# EAGLE design Me-Infrared Reciver Decode v2.0 (EAGLE 6.2)
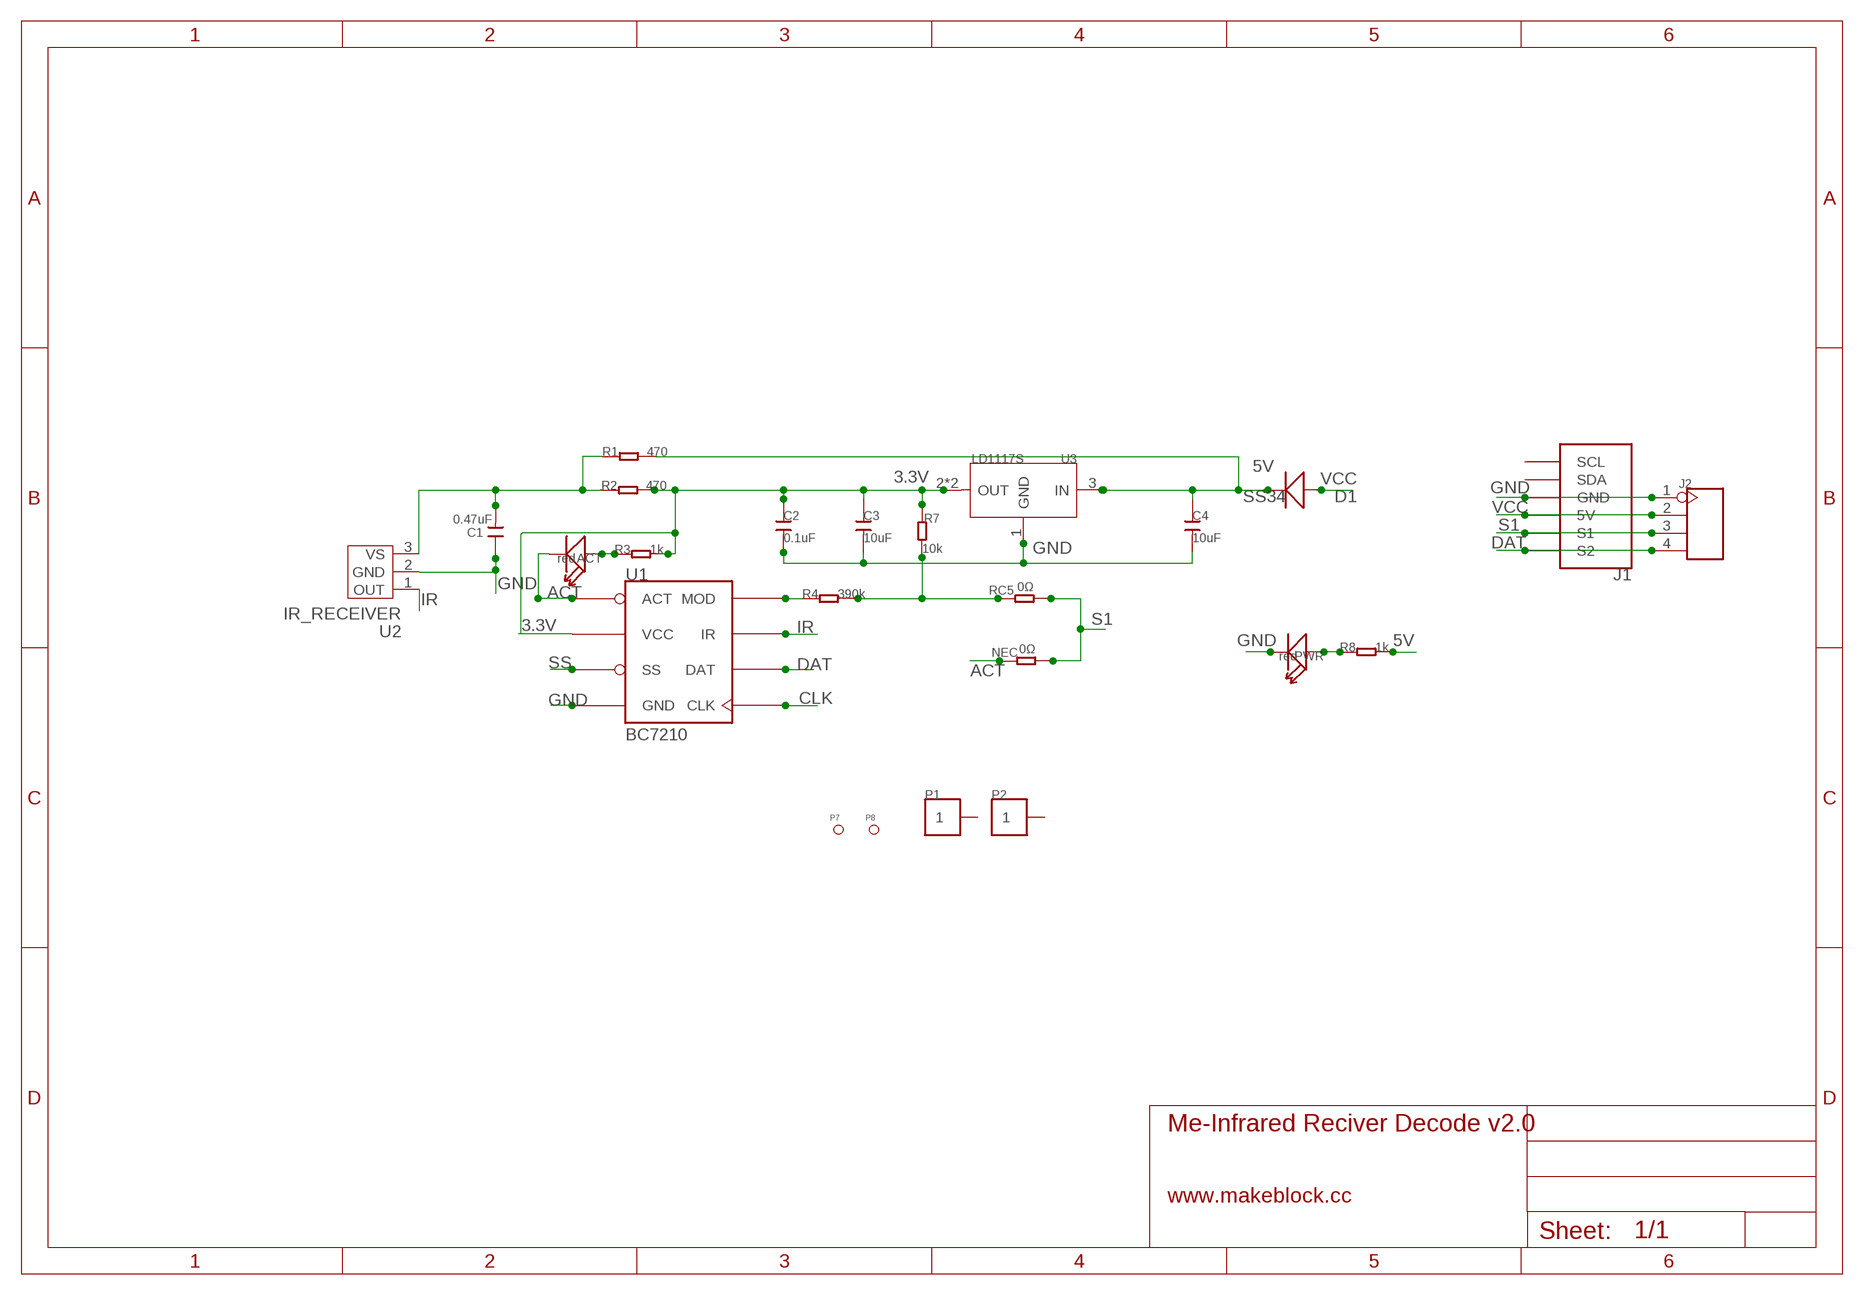
[diagram p0: schematic, sheet 1]

## Parts
ACT  red  LED'0603'  [LED-0603]
C1  0.47uF  C-0603  [0603]
C2  0.1uF  C-0603  [0603]
C3  10uF  C-0603  [0603]
C4  10uF  C-0603  [0603]
D1  SS34  D'SMA'  [D2010]
J1  RJ11-6P6C-DIGI  [RJ11-6P6C]
J2  HEADER-4P-60/35MIL  [4P-65/35MIL]
NEC  0Ω  R-0603  [0603]
P1  PAD-1P-4MM  [HOLE-01]
P2  PAD-1P-4MM  [HOLE-01]
P7  PAD-MARK  [ROUND-MARK-1.0]
P8  PAD-MARK  [ROUND-MARK-1.0]
PWR  red  LED'0603'  [LED-0603]
R1  470  R-0603  [0603]
R2  470  R-0603  [0603]
R3  1k  R-0603  [0603]
R4  390k  R-0603  [0603]
R7  10k  R-0603  [0603]
R8  1k  R-0603  [0603]
RC5  0Ω  R-0603  [0603]
U1  BC7210  [BC7210]
U2  IR_RECEIVER  [IR_RECEIVER]
U3  LD1117S  [SOT-223]

## Nets
3.3V: C2.1 C3.1 R2.2 R3.2 R7.2 U1.P$2(VCC) U3.2(OUT) U3.TER(OUT)
5V: C4.1 D1.- R1.2 R8.2 U3.3(IN)
ACT: ACT.- NEC.1 U1.P$1(ACT)
CLK: U1.P$5(CLK)
DAT: J1.6(S2) J2.4 U1.P$6(DAT)
GND: C1.1 C2.2 C3.2 C4.2 J1.3(GND) J2.1 PWR.- U1.P$4(GND) U2.2(GND) U3.1(GND)
IR: U1.P$7(IR) U2.1(OUT)
N$1: R4.1 U1.P$8(MOD)
N$2: PWR.+ R8.1
N$3: C1.2 R1.1 R2.1 U2.3(VS)
N$4: R4.2 R7.1 RC5.1
N$6: ACT.+ R3.1
S1: J1.5(S1) J2.3 NEC.2 RC5.2
SS: U1.P$3(SS)
VCC: D1.+ J1.4(5V) J2.2
Unconnected: J1.1(SCL) J1.2(SDA) P1.1 P2.1

## Notes on the sheet
- www.makeblock.cc

## Library data of the parts
ACT PWR = Discrete:LED*
C1-C4 = Discrete:C*: Ceramic Capacitors
D1 = Discrete:D*
J1 = Makeblock:RJ11-6P6C-DIGI
J2 = Connector:HEADER-4P
NEC R1-R4 R7 R8 RC5 = Discrete:R*
P1 P2 = Makeblock:PAD-1P*
P7 P8 = Discrete:PAD-MARK; PARTNO: DNP
U1 = Makeblock:BC7210
U2 = Makeblock:IR_RECEIVER
U3 = IC:LD1117: Low Drop Fixed And Adjustable Positive Voltage Regulators http://www.datasheetcatalog.org/datasheet/SGSThomsonMicroelectronics/mXuqtqv.pdf

## Board
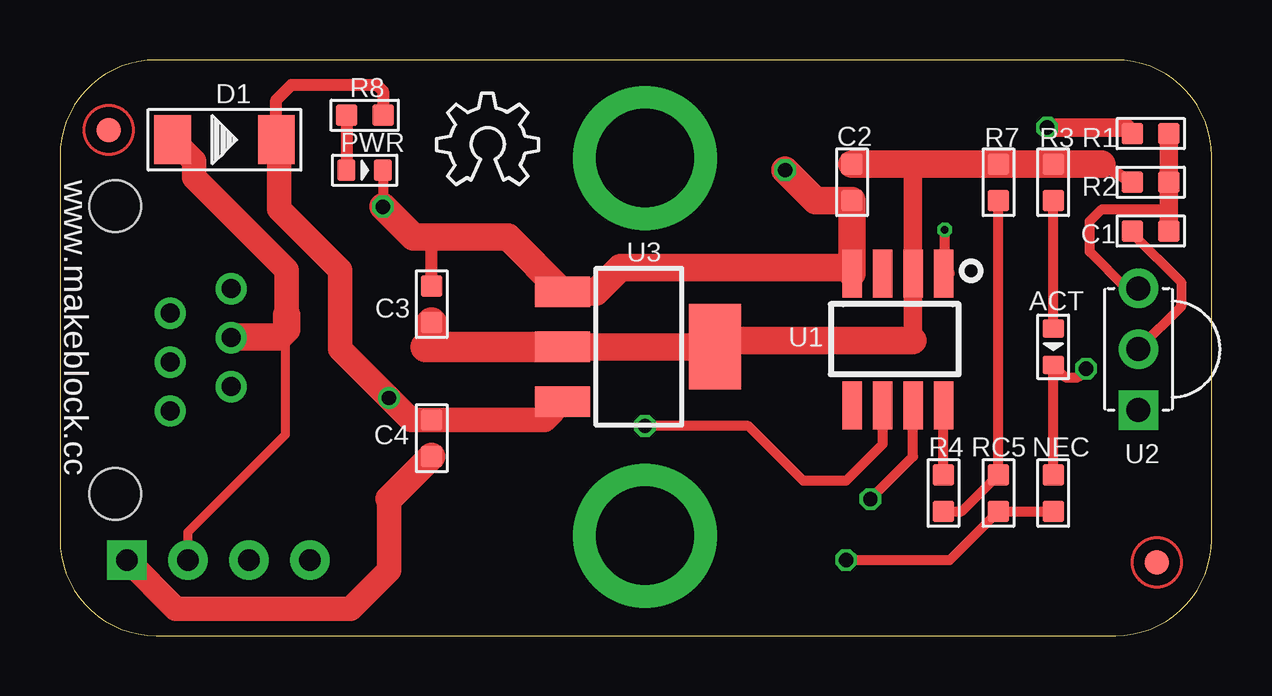
[diagram p1: board, top side]
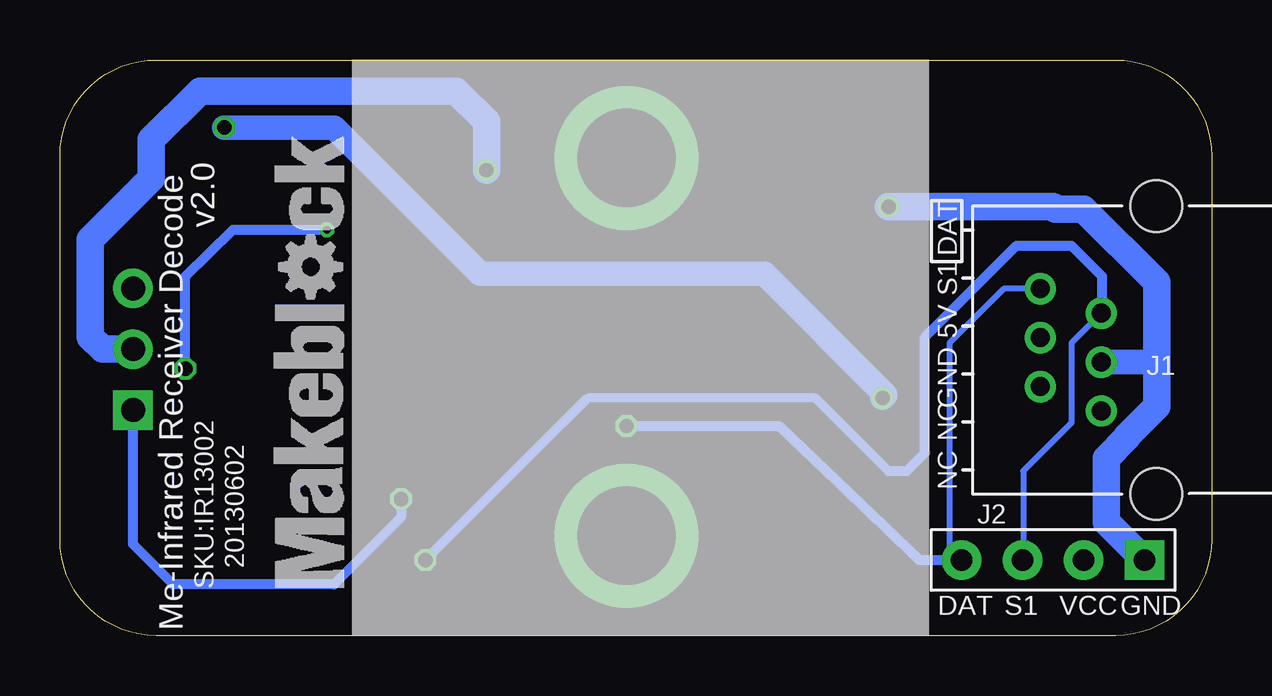
[diagram p2: board, bottom side, seen from below]

Size 48 x 24 mm. Coordinates in mm from the lower left corner, seen from the top.
Outline: 0,20 0,4 arc90 4,0 44,0 arc90 48,4 48,20 arc90 44,24 4,24 arc90 0,20
Copper layers (1*16): Top 0.035mm / dielectric 1.5mm / Bottom 0.035mm
Design rules: minimum track width 6mil, minimum drill 12mil, track to track 8mil, track to pad 8mil, pad to pad 8mil, via to via 8mil, smd to smd 0mil, copper to edge 10mil, drill to drill 10mil, minimum pad ring 10mil, minimum via ring 6mil, stop-mask expansion 2mil, vias tented up to drill 100mil, thermal gap 10mil

### Footprints (pad centres in the part's own frame; a part is rotated, then mirrored left to right if it is on the bottom)
LED-0603 = smd 0.762 x 0.889: + -0.762,0; - 0.762,0
0603 = smd 0.889 x 0.889: 1 -0.762,0; 2 0.762,0
D2010 = smd 1.524 x 2.032: + -2.159,0; - 2.159,0
RJ11-6P6C = drill 0.8: 1 -2.55,1.8; 2 -1.53,4.34; 3 -0.51,1.8; 4 0.51,4.34; 5 1.53,1.8; 6 2.55,4.34 | hole 2.15: -6,-0.5; 6,-0.5
4P-65/35MIL = drill 0.889 pad 1.651 square: 1 0,3.81 | drill 0.889 pad 1.651: 2 0,1.27; 3 0,-1.27; 4 0,-3.81
HOLE-01 = drill 4.1 pad 6: 1 0,0
ROUND-MARK-1.0 = smd 1.016 x 1.016: P$1 0,0
BC7210 = smd 2 x 0.8: P$1 0,0; P$2 0,-1.27; P$3 0,-2.54; P$4 0,-3.81; P$5 5.5,-3.81; P$6 5.5,-2.54; P$7 5.5,-1.27; P$8 5.5,0
IR_RECEIVER = drill 1 pad 1.65 square: 1 -2.54,0 | drill 1 pad 1.65: 2 0,0; 3 2.54,0
SOT-223 = smd 1.27 x 2.286: 1 -2.286,-3.175; 2 0,-3.175; 3 2.286,-3.175 | smd 3.556 x 2.159: TER 0,3.175

### Placement (x,y rotation side)
ACT  41.4,12.04 270 top
C1  45.47,16.87 0 top
C2  33.02,18.9 270 top
C3  15.49,13.82 90 top
C4  15.49,8.23 270 top
D1  6.86,20.68 0 top
J1  2.79,11.91 90 bottom
J2  6.6,3.15 270 bottom
NEC  41.4,5.94 270 top
P1  24.38,19.91 90 top
P2  24.38,4.17 0 top
P7  2.03,21.08 0 top
P8  45.72,3.05 0 top
PWR  12.7,19.41 0 top
R1  45.47,20.93 180 top
R2  45.47,18.9 180 top
R3  41.4,18.9 90 top
R4  36.83,5.94 270 top
R7  39.12,18.9 90 top
R8  12.7,21.69 0 top
RC5  39.12,5.94 270 top
U1  36.83,15.09 270 top
U2  44.96,11.94 90 top
U3  24.13,12.04 270 top
U$1  [OSHW_6X150_NOTEXT]  15.7,18.8 0 top
U$2  [LOGO-3/2]  36.16,1.98 90 bottom

### Tracks (layer width: path | path; a pad name or v marks a point on that pad's centre or on a via)
3.3V
  Top 0.406: U3.TER 27.3,12.29
  Top 0.508: 43.43,19.66 R2.2
  Top 0.762: 35.56,19.66 U1.P$2 35.56,12.29
  Top 1.143: C2.1 35.56,19.66 R7.2 R3.2 43.43,19.66 | U3.TER U3.2 | 27.3,12.29 35.56,12.29
  Top 1.27: U3.2 15.49,12.04 | 15.49,12.04 15.24,12.04 | C3.1 15.49,12.04
5V  (via drill 0.6)
  Top 0.254: 44.45,21.18 R1.2
  Top 0.406: 20.57,9.5 U3.3
  Top 0.508: D1.- 9.02,22.33 9.65,22.96 13.21,22.96 13.46,22.71 R8.2
  Top 0.762: v41.15,21.18 44.45,21.18
  Top 1.016: U3.3 20.19,8.99 C4.1 14.63,8.99 v13.72,9.91 11.68,11.94 11.68,15.24 9.14,17.78 9.14,20.55 D1.-
  Bottom 1.016: v41.15,21.18 36.58,21.18 30.48,15.09 18.64,15.09 13.59,10.03 v13.72,9.91
ACT  (via drill 0.3 pad 0.61, 0.6)
  Top 0.406: NEC.1 ACT.- 41.91,10.77 42.42,10.77 v42.77,11.12 | U1.P$1 37.08,15.09 36.88,15.7 v36.88,16.92
  Bottom 0.406: v36.88,16.92 40.79,16.92 42.79,14.96 | v42.77,11.12 42.77,14.94 42.79,14.96 | 42.79,14.96 42.79,11.14 42.67,11.02
DAT  (via drill 0.6)
  Top 0.406: U1.P$6 34.29,7.98 32.77,6.45 30.99,6.45 28.7,8.74 v24.38,8.74
  Bottom 0.254: J1.6 8.65,14.46 10.92,12.19 10.92,3.66 J2.4
  Bottom 0.406: v24.38,8.74 18.03,8.74 12.19,3.15 J2.4
GND  (via drill 0.6)
  Top 0.406: PWR.- v13.46,17.88 | 20.7,14.58 U3.1 | 44.5,16.66 C1.1 44.7,16.76 46.74,14.73 46.74,13.79 46.74,13.72 U2.2
  Top 0.508: C3.2 15.49,16.61
  Top 1.016: 13.72,5.69 13.72,2.72 12.12,1.12 4.83,1.12 J2.1
  Top 1.143: v30.23,19.41 31.5,18.14 C2.2 U1.P$4 32.77,15.34 23.37,15.34 22.35,14.33 U3.1 18.67,16.61 15.49,16.61 14.73,16.61 v13.46,17.88 | 13.72,5.69 C4.2
  Bottom 1.016: J1.3 2.31,11.4 2.29,11.43
  Bottom 1.143: 6.6,17.88 6.63,17.88 | 6.63,17.88 v13.46,17.88 | v30.23,19.41 30.23,21.44 31.5,22.71 42.16,22.71 44.2,20.68 44.2,19.05 46.74,16.51 46.74,12.45 46.23,11.94 U2.2 | 6.6,17.88 6.63,17.88 | J2.1 4.39,4.75 4.39,7.39 3.53,8.26 3.53,8.31 2.29,9.55 2.29,10.52 2.29,11.43 2.29,14.66 2.29,14.73 5.33,17.78 6.5,17.78 6.6,17.88
IR  (via drill 0.6)
  Top 0.406: v33.78,5.69 35.56,7.47 U1.P$7
  Bottom 0.406: v33.78,5.69 33.78,4.93 36.58,2.13 43.28,2.13 44.96,3.81 44.96,9.14 | 44.96,9.14 44.96,9.27 | U2.1 44.96,9.14
N$1
  Top 0.406: R4.1 U1.P$8
N$2
  Top 0.508: R8.1 PWR.+
N$3
  Top 0.406: 46.23,17.78 43.43,17.78 42.93,17.27 42.93,16 44.48,14.45 44.5,14.48 U2.3
  Top 0.762: C1.2 46.23,17.78 R1.1 R2.1
N$4
  Top 0.406: R4.2 37.59,5.18 RC5.1 R7.1
N$6
  Top 0.406: ACT.+ R3.1
S1  (via drill 0.6)
  Top 0.406: v32.77,3.15 37.08,3.15 RC5.2 NEC.2
  Bottom 0.254: J2.3 7.85,3.17 7.85,6.86 5.84,8.87 5.84,12.19 J1.5
  Bottom 0.381: 13.46,6.86 16.51,9.91 26.01,9.91 26.09,9.83
  Bottom 0.406: 26.09,9.83 v32.77,3.15 | 13.46,6.86 12.7,6.86 11.94,7.62 11.94,12.45 8.13,16.26 5.84,16.26 4.57,14.99 4.57,13.46 J1.5
VCC
  Top 0.381: J2.2 5.33,4.32 9.4,8.38 9.4,12.19 9.14,12.45
  Top 0.406: 4.83,20.55 D1.+
  Top 1.016: D1.+ 5.59,19.79 5.59,19.1 8.33,16.36 9.45,15.24 9.45,13.36
  Top 1.143: 9.45,13.36 9.45,12.75 9.14,12.45 7.16,12.45 J1.4

### Text on the board
tPlace: www.makeblock.cc
bPlace: DAT | v2.0 | S1 | 5V | GND | NC | SKU:IR13002 | NC | 20130602 | GND | VCC | S1 | DAT | Me-Infrared Receiver Decode